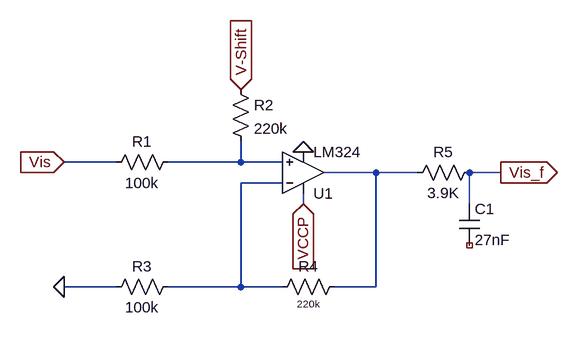
[diagram p0: schematic sig_cond_shunt.asc]
sig_cond_shunt.asc, the LTspice schematic file:
Version 4.1
SHEET 1 880 680
WIRE -208 96 -288 96
WIRE -16 96 -16 64
WIRE -16 96 -128 96
WIRE 48 96 -16 96
WIRE 192 112 112 112
WIRE 256 112 192 112
WIRE 384 112 336 112
WIRE 48 128 -16 128
WIRE 80 160 80 144
WIRE 336 160 336 112
WIRE -208 288 -288 288
WIRE -16 288 -16 128
WIRE -16 288 -128 288
WIRE 48 288 -16 288
WIRE 192 288 192 112
WIRE 192 288 128 288
FLAG -16 -16 V-Shift
IOPIN -16 -16 In
FLAG -288 96 Vis
IOPIN -288 96 In
FLAG -288 288 0
FLAG 80 160 VCCP
IOPIN 80 160 In
FLAG 384 112 Vis_f
IOPIN 384 112 Out
FLAG 80 80 0
SYMBOL OpAmps\\opamp2 80 176 M180
SYMATTR InstName U1
SYMATTR Value LM324
SYMBOL res -32 -32 R0
SYMATTR InstName R2
SYMATTR Value 220k
SYMBOL res -112 80 R90
WINDOW 0 0 56 VBottom 2
WINDOW 3 32 56 VTop 2
SYMATTR InstName R1
SYMATTR Value 100k
SYMBOL res -112 272 R90
WINDOW 0 0 56 VBottom 2
WINDOW 3 32 56 VTop 2
SYMATTR InstName R3
SYMATTR Value 100k
SYMBOL res 144 272 R90
WINDOW 0 0 56 VBottom 2
WINDOW 3 32 56 VTop 1
SYMATTR InstName R4
SYMATTR Value 220k
SYMBOL res 352 96 R90
WINDOW 0 0 56 VBottom 2
WINDOW 3 32 56 VTop 2
SYMATTR InstName R5
SYMATTR Value 3.9K
SYMBOL cap 320 160 R0
SYMATTR InstName C1
SYMATTR Value 27nF

The netlist it stands for:
* sig_cond_shunt.asc
X§U1 N001 N003 VCCP 0 N002 LM324  ; pins In+ In- V+ V- OUT
R2 V-Shift N001 220k
R1 N001 Vis 100k
R3 N003 0 100k
R4 N002 N003 220k
R5 Vis_f N002 3.9K
C1 Vis_f NC_01 27nF
.backanno
.end